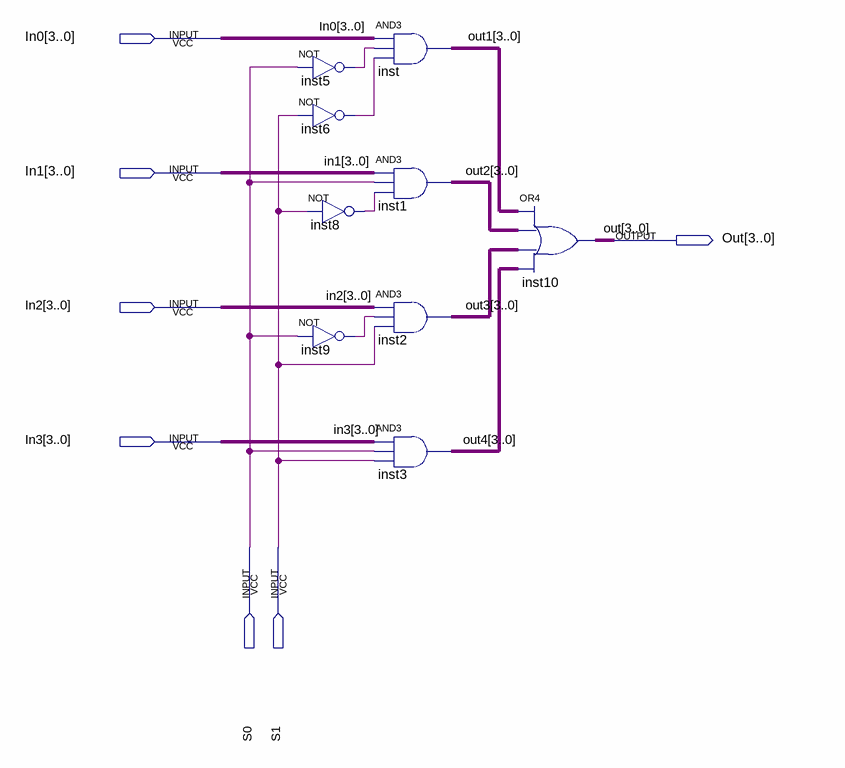
[diagram p0: schematic sheet]
// Quartus schematic 4to1Mux_Bus.bdf as structural Verilog: 9 symbols, 7 pins
module \4to1Mux_Bus  (
  input  [3:0] In0,
  input  [3:0] In1,
  input  [3:0] In2,
  input  [3:0] In3,
  input  S0,
  input  S1,
  output [3:0] Out
);

  wire inst5_out, inst6_out, inst8_out, inst9_out;
  wire [3:0] out1, out2, out3, out4;

  not inst5 (inst5_out, S0);
  not inst6 (inst6_out, S1);
  not inst9 (inst9_out, S0);
  assign out1 = In0 & {4{inst5_out}} & {4{inst6_out}};  // AND3 inst, 4 bits wide
  assign out2 = In1 & {4{S0}} & {4{inst8_out}};  // AND3 inst1, 4 bits wide
  not inst8 (inst8_out, S1);
  assign out3 = In2 & {4{inst9_out}} & {4{S1}};  // AND3 inst2, 4 bits wide
  assign out4 = In3 & {4{S0}} & {4{S1}};  // AND3 inst3, 4 bits wide
  assign Out = out1 | out2 | out3 | out4;  // OR4 inst10, 4 bits wide
endmodule
